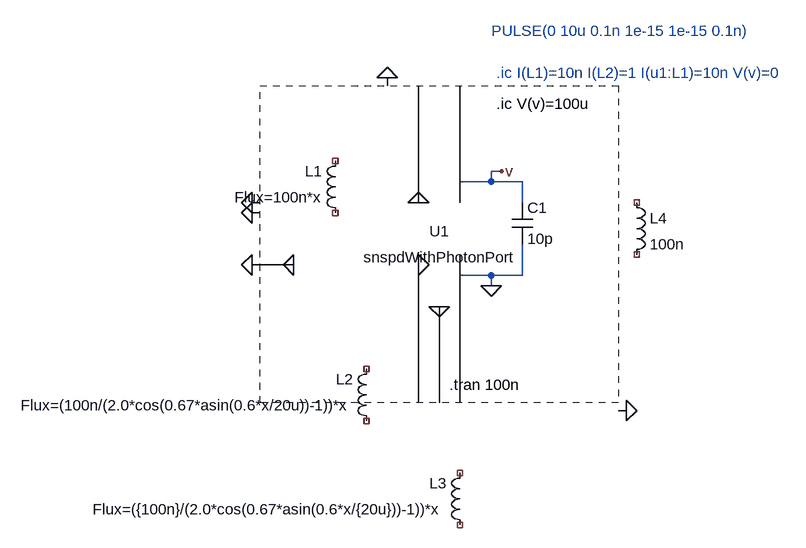
[diagram p0: schematic trapz_vs_gear.asc]
trapz_vs_gear.asc, the LTspice schematic file:
Version 4
SHEET 1 900 792
WIRE 352 160 336 160
WIRE 336 176 336 160
WIRE 336 176 288 176
WIRE 384 176 336 176
WIRE 288 208 288 176
WIRE 384 208 384 176
WIRE 288 304 288 288
WIRE 288 320 288 304
WIRE 336 320 288 320
WIRE 384 320 384 272
WIRE 384 320 336 320
WIRE 336 336 336 320
FLAG 256 368 0
FLAG 224 208 0
FLAG 336 336 0
FLAG 352 160 v
FLAG -32 304 0
FLAG -32 224 0
FLAG -32 208 0
FLAG 176 16 0
FLAG 32 304 0
FLAG 544 528 0
FLAG 224 304 0
SYMBOL ind 112 240 R180
WINDOW 0 36 80 Left 2
WINDOW 3 36 40 Left 2
SYMATTR InstName L1
SYMATTR Value Flux=100n*x
SYMATTR SpiceLine Rser=1e-100
SYMBOL Cap 368 208 R0
SYMATTR InstName C1
SYMATTR Value 10p
SYMATTR SpiceLine Rser=0
SYMBOL qnn-spice/SNSPD/snspdWithPhotonPort 288 256 R0
SYMATTR InstName U1
SYMBOL ind 160 560 R180
WINDOW 0 36 80 Left 2
WINDOW 3 36 40 Left 2
SYMATTR InstName L2
SYMATTR Value Flux=(100n/(2.0*cos(0.67*asin(0.6*x/20u))-1))*x
SYMATTR SpiceLine Rser=1e-100
SYMBOL ind 304 720 R180
WINDOW 0 36 80 Left 2
WINDOW 3 36 40 Left 2
SYMATTR InstName L3
SYMATTR Value Flux=({100n}/(2.0*cos(0.67*asin(0.6*x/{20u}))-1))*x
SYMATTR SpiceLine Rser=1e-100
SYMBOL ind 544 192 R0
SYMATTR InstName L4
SYMATTR Value 100n
TEXT 272 488 Left 2 !.tran 100n
TEXT 344 56 Left 2 !.ic V(v)=100u
TEXT 344 8 Left 2 ;.ic I(L1)=10n I(L2)=1 I(u1:L1)=10n V(v)=0
TEXT 336 -56 Left 2 ;PULSE(0 10u 0.1n 1e-15 1e-15 0.1n)

The netlist it stands for:
* trapz_vs_gear.asc
L1 NC_01 NC_02 Flux=100n*x Rser=1e-100
C1 v 0 10p Rser=0
* U1: snspdWithPhotonPort (symbol qnn-spice/SNSPD/snspdWithPhotonPort not available, pin order unknown); nets seen at it: 0, v
L2 NC_03 NC_04 Flux=(100n/(2.0*cos(0.67*asin(0.6*x/20u))-1))*x Rser=1e-100
L3 NC_05 NC_06 Flux=({100n}/(2.0*cos(0.67*asin(0.6*x/{20u}))-1))*x Rser=1e-100
L4 NC_07 NC_08 100n
.tran 100n
.ic V(v)=100u
* .ic I(L1)=10n I(L2)=1 I(u1:L1)=10n V(v)=0
* PULSE(0 10u 0.1n 1e-15 1e-15 0.1n)
.backanno
.end